# EAGLE schematic Ice-LogicBench (EAGLE 7.5.0)
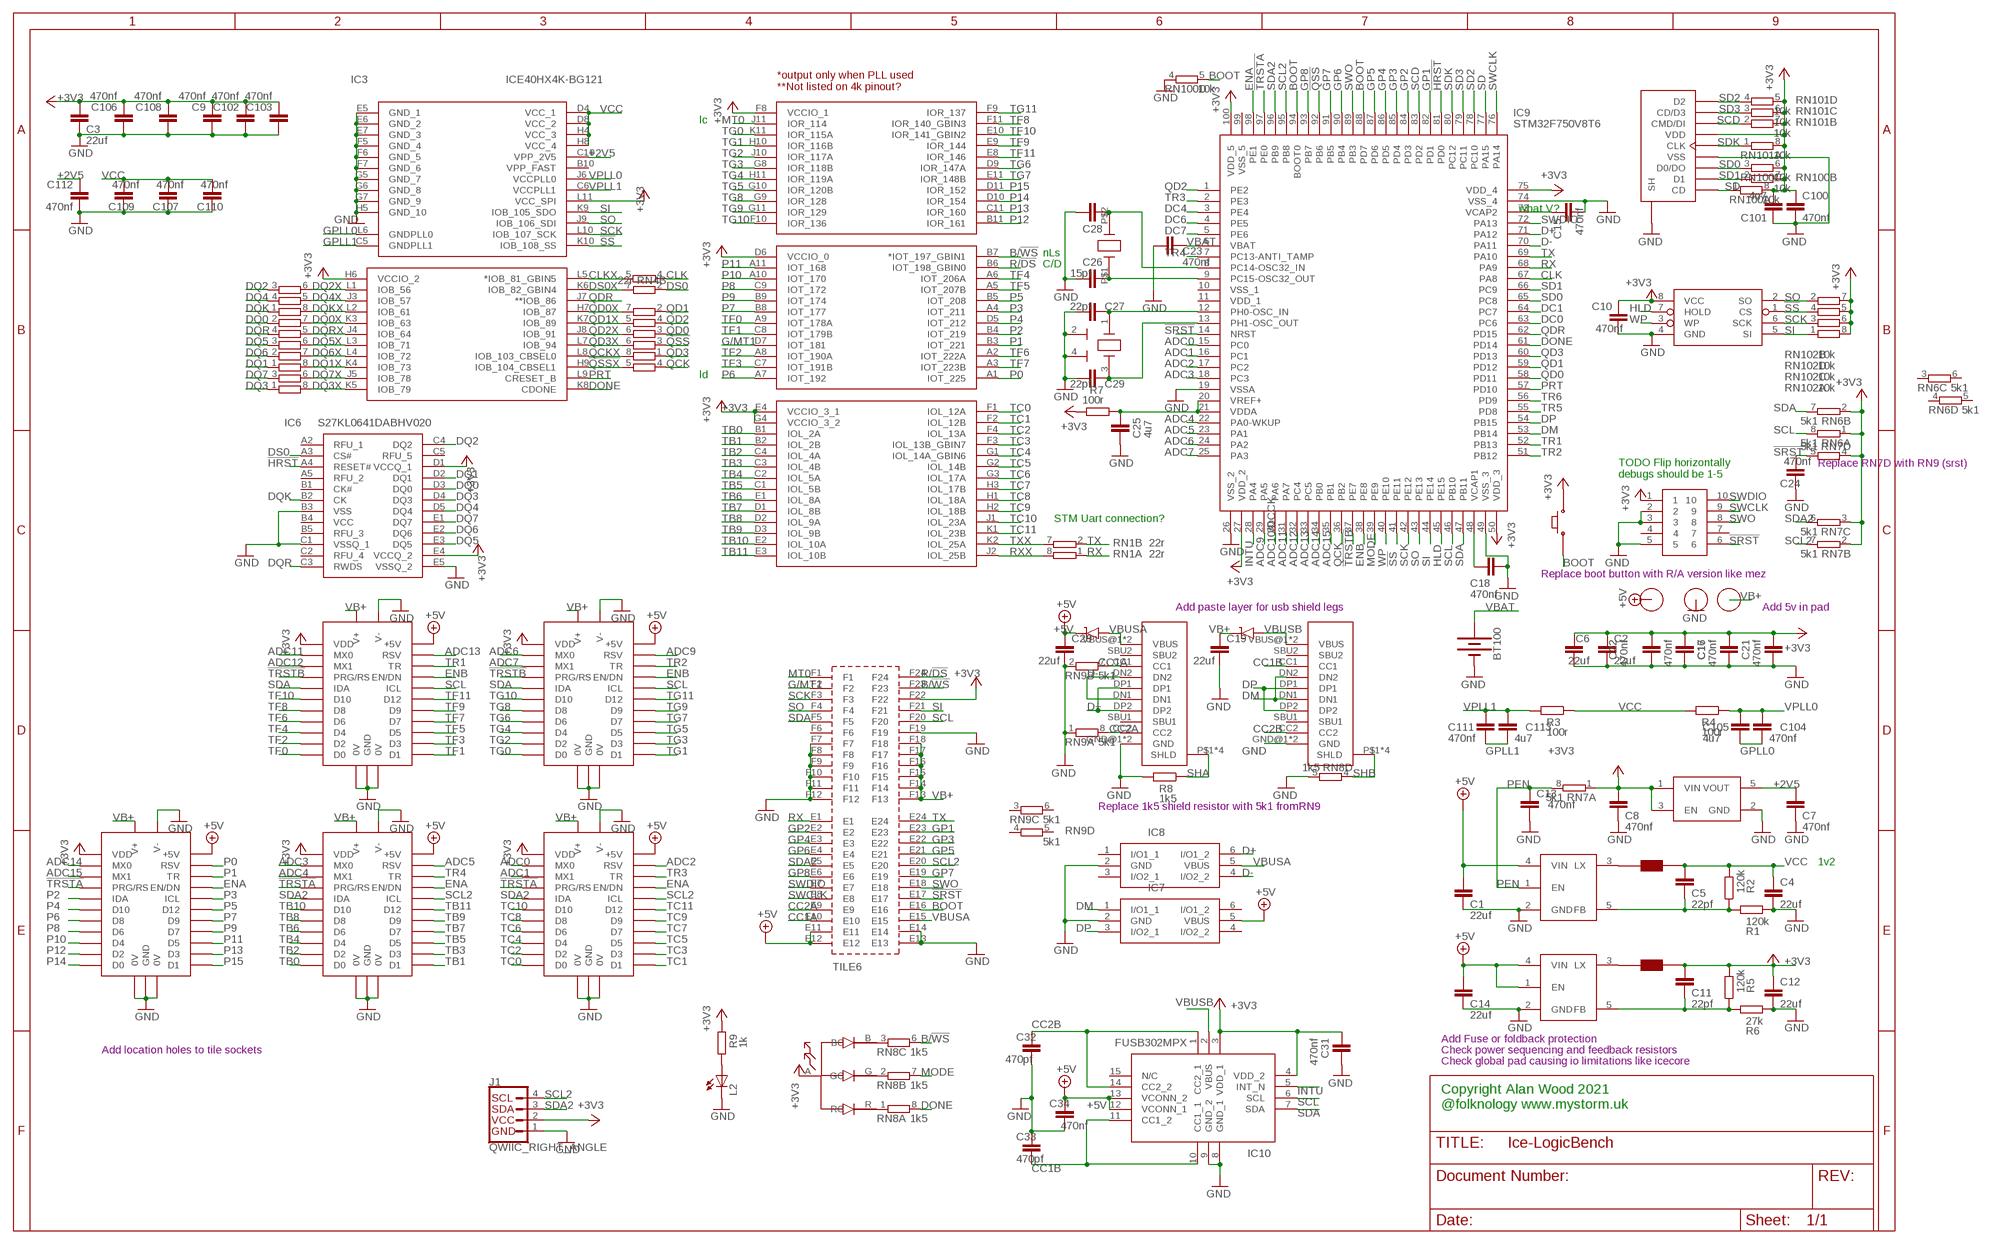
[diagram p0: schematic, sheet 1]

## Parts
B1  PUSH_BUTTON  [3X4MM_BUTTON]
BT100  BATTERY-20MM_SMD  [BATTCON_20MM]
C1  22uf  C-EUC0603  [C0603]
C2  22uf  C-EUC0603  [C0603]
C3  22uf  C-EUC0603  [C0603]
C4  22uf  C-EUC0603  [C0603]
C5  22pf  C-EUC0402  [C0402]
C6  22uf  C-EUC0603  [C0603]
C7  470nf  C-EUC0402  [C0402]
C8  470nf  C-EUC0402  [C0402]
C9  470nf  C-EUC0402  [C0402]
C10  470nf  C-EUC0402  [C0402]
C11  22pf  C-EUC0402  [C0402]
C12  22uf  C-EUC0603  [C0603]
C13  470nf  C-EUC0402  [C0402]
C14  22uf  C-EUC0603  [C0603]
C15  470nf  C-EUC0402  [C0402]
C16  470nf  C-EUC0402  [C0402]
C17  470nf  C-EUC0402  [C0402]
C18  470nf  C-EUC0402  [C0402]
C19  22uf  C-EUC0603  [C0603]
C20  22uf  C-EUC0603  [C0603]
C21  470nf  C-EUC0402  [C0402]
C22  470nf  C-EUC0402  [C0402]
C23  470nf  C-EUC0402  [C0402]
C24  470nf  C-EUC0402  [C0402]
C25  4u7  C-EUC0402  [C0402]
C26  15pf  C-EUC0402  [C0402]
C27  22pf  C-EUC0402  [C0402]
C28  15pf  C-EUC0402  [C0402]
C29  22pf  C-EUC0402  [C0402]
C31  470nf  C-EUC0402  [C0402]
C32  470pf  C-EUC0402  [C0402]
C33  470pf  C-EUC0402  [C0402]
C34  470nf  C-EUC0402  [C0402]
C100  470nf  C-EUC0402  [C0402]
C101  4u7  C-EUC0402  [C0402]
C102  470nf  C-EUC0402  [C0402]
C103  470nf  C-EUC0402  [C0402]
C104  470nf  C-EUC0402  [C0402]
C105  4u7  C-EUC0402  [C0402]
C106  470nf  C-EUC0402  [C0402]
C107  470nf  C-EUC0402  [C0402]
C108  470nf  C-EUC0402  [C0402]
C109  470nf  C-EUC0402  [C0402]
C110  470nf  C-EUC0402  [C0402]
C111  470nf  C-EUC0402  [C0402]
C112  470nf  C-EUC0402  [C0402]
C113  4u7  C-EUC0402  [C0402]
CN1  USB-C-16  [USB-C]
CN2  USB-C-16  [USB-C]
CN3  2X5-HEADER  [1.27-2X5-HEADER]
H1  HOLE2.5MM-LARGE  [2M5-LARGE]
H3  HOLE2.5MM-LARGE  [2M5-LARGE]
H4  HOLE2.5MM-LARGE  [2M5-LARGE]
I1  NRS4018  [NRC4018]
I2  NRS4018  [NRC4018]
IC1  AP3429/A  [TSOP-5/SOT23-5]
IC2  NCP114  [TSOP-5/SOT23-5]
IC3  ICE40HX4K-BG121  [BGA121C80P11X11_900X900X110]
IC4  AT25SDF041A  [SOIC-8-NARROW]
IC5  AP3429/A  [TSOP-5/SOT23-5]
IC6  S27KL0641DABHV020  [BGA24C100P5X5_600X800X100]
IC7  USBLC6-2SC6  [SOT95P280X145-6N]
IC8  USBLC6-2SC6  [SOT95P280X145-6N]
IC9  STM32F750V8T6  [QFP50P1600X1600X160-100N]
IC10  FUSB302MPX  [QFN50P250X250X80-15N]
J1  QWIIC_RIGHT_ANGLE  QWIIC_CONNECTORJS-1MM  [JST04_1MM_RA]
L1  RGB_LED  [RGB_LED_IMM]
L2  LEDCHIPLED_1206  [CHIPLED_1206]
R1  120k  R-EU_R0402  [R0402]
R2  120k  R-EU_R0402  [R0402]
R3  100r  R-EU_R0402  [R0402]
R4  100r  R-EU_R0402  [R0402]
R5  120k  R-EU_R0402  [R0402]
R6  27k  R-EU_R0402  [R0402]
R7  100r  R-EU_R0402  [R0402]
R8  1k5  R-EU_R0402  [R0402]
R9  1k  R-EU_R0402  [R0402]
RN1  22r  4R-NEXB38V  [EXB38V]
RN2  22r  4R-NEXB38V  [EXB38V]
RN3  22r  4R-NEXB38V  [EXB38V]
RN4  22r  4R-NEXB38V  [EXB38V]
RN5  22r  4R-NEXB38V  [EXB38V]
RN6  5k1  4R-NEXB38V  [EXB38V]
RN7  5k1  4R-NEXB38V  [EXB38V]
RN8  1k5  4R-NEXB38V  [EXB38V]
RN9  5k1  4R-NEXB38V  [EXB38V]
RN100  10k  4R-NEXB38V  [EXB38V]
RN101  10k  4R-NEXB38V  [EXB38V]
RN102  10k  4R-NEXB38V  [EXB38V]
SD100  TF-15X15  [SDCARD]
TILE1  UTILE_LPCARRIER_SMD_MALE_1.27  [UTILE_LP]
TILE2  UTILE_LPCARRIER_SMD_MALE_1.27  [UTILE_LP]
TILE3  UTILE_LPCARRIER_SMD_MALE_1.27  [UTILE_LP]
TILE4  UTILE_LPCARRIER_SMD_MALE_1.27  [UTILE_LP]
TILE5  UTILE_LPCARRIER_SMD_MALE_1.27  [UTILE_LP]
TILE6  HYPER-TILECARRIER  [HYPER-TILE]
U$1  SS54  [SMA-NARROW]
U$2  SS54  [SMA-NARROW]
Y1  12MZ  7M-25  [CRYSTAL-3.2X2.5]
Y2  FC-135  [FC135]

## Nets
!HRST: IC6.A4(RESET#) IC9.81(PD0)
!QSS: IC9.92(PB6) RN4.3
!QSSX: IC3.H9(IOB_104_CBSEL1) RN5.5
!SRST: C24.2 CN3.6 IC9.14(NRST) RN7.5 TILE6.E17
!SS: IC3.K10(IOB_108_SS) IC4.1(CS) IC9.41(PE11) RN102.4
!TRSTA: IC9.97(PE0) TILE1.P$15(PRG/RS) TILE2.P$15(PRG/RS) TILE4.P$15(PRG/RS)
!TRSTB: IC9.37(PE7) TILE3.P$15(PRG/RS) TILE5.P$15(PRG/RS)
+2V5: C7.2 C112.1 IC2.5(VOUT) IC3.C10(VPP_2V5)
+3V3: B1.P$1 C2.1 C3.2 C6.2 C8.2 C9.1 C10.1 C11.2 C12.1 C16.2 C17.2 C21.2 C22.2 C31.2 C100.1 C101.2 C102.1 C103.1 C106.1 C108.1 CN3.1 I2.P$2 IC2.1(VIN) IC2.3(EN) IC3.D6(VCCIO_0) IC3.E4(VCCIO_3_1) IC3.F8(VCCIO_1) IC3.G4(VCCIO_3_2) IC3.H6(VCCIO_2) IC3.L11(VCC_SPI) IC4.8(VCC) IC6.D1(VCCQ_1) IC6.E4(VCCQ_2) IC9.27(VDD_2) IC9.50(VDD_3) IC9.75(VDD_4) IC9.100(VDD_5) IC10.3(VDD_1) IC10.4(VDD_2) J1.2 L1.A(ANODE) R5.2 R7.2 R9.1 RN6.1 RN6.2 RN7.1 RN7.2 RN7.3 RN7.4 RN100.6 RN100.7 RN100.8 RN101.5 RN101.6 RN101.7 RN101.8 RN102.5 RN102.6 RN102.7 RN102.8 SD100.P$6(VDD) TILE1.P$18(VDD) TILE2.P$18(VDD) TILE3.P$18(VDD) TILE4.P$18(VDD) TILE5.P$18(VDD) TILE6.F22
+5V: C1.2 C14.2 C20.1 C34.2 H1.P$1(P) IC1.4(VIN) IC5.1(EN) IC5.4(VIN) IC7.5(VBUS) IC10.12(VCONN_1) IC10.13(VCONN_2) TILE1.P$43(+5V) TILE2.P$43(+5V) TILE3.P$43(+5V) TILE4.P$43(+5V) TILE5.P$43(+5V) TILE6.E11 TILE6.E12 U$2.C(CATHODE)
ADC0: IC9.15(PC0) TILE4.P$17(MX0)
ADC1: IC9.16(PC1) TILE4.P$16(MX1)
ADC2: IC9.17(PC2) TILE4.P$42(RSV)
ADC3: IC9.18(PC3) TILE1.P$17(MX0)
ADC4: IC9.22(PA0-WKUP) TILE1.P$16(MX1)
ADC5: IC9.23(PA1) TILE1.P$42(RSV)
ADC6: IC9.24(PA2) TILE5.P$17(MX0)
ADC7: IC9.25(PA3) TILE5.P$16(MX1)
ADC9: IC9.29(PA5) TILE5.P$42(RSV)
ADC10/DCCK: IC9.30(PA6)
ADC11: IC9.31(PA7) TILE3.P$17(MX0)
ADC12: IC9.32(PC4) TILE3.P$16(MX1)
ADC13: IC9.33(PC5) TILE3.P$42(RSV)
ADC14: IC9.34(PB0) TILE2.P$17(MX0)
ADC15: IC9.35(PB1) TILE2.P$16(MX1)
B/!WS: IC3.B7(*IOT_197_GBIN1) RN8.6 TILE6.F23
BOOT: B1.P$2 IC9.88(PD7) IC9.94(BOOT0) RN100.5 TILE6.E16
CC1A: CN1.CC1 RN9.7 TILE6.E10
CC1B: C33.1 CN2.CC1 IC10.10(CC1_1) IC10.11(CC1_2)
CC2A: CN1.CC2 RN9.8 TILE6.E9
CC2B: C32.2 CN2.CC2 IC10.1(CC2_1) IC10.14(CC2_2)
CLK: IC9.67(PA8) RN3.4
CLKX: IC3.L5(*IOB_81_GBIN5) RN3.5
D+: CN1.DP1 CN1.DP2 IC8.6(I/O1_2) IC9.71(PA12)
D-: CN1.DN1 CN1.DN2 IC8.4(I/O2_2) IC9.70(PA11)
DC0: IC9.63(PC6)
DC1: IC9.64(PC7)
DC4: IC9.3(PE4)
DC6: IC9.4(PE5)
DC7: IC9.5(PE6)
DM: CN2.DN1 CN2.DN2 IC7.1(I/O1_1) IC9.53(PB14)
DONE: IC3.K8(CDONE) IC9.61(PD14) RN8.8
DP: CN2.DP1 CN2.DP2 IC7.3(I/O2_1) IC9.54(PB15)
DQ0: IC6.D3(DQ0) RN2.2
DQ0X: IC3.K3(IOB_63) RN2.7
DQ1: IC6.D2(DQ1) RN3.1
DQ1X: IC3.K4(IOB_73) RN3.8
DQ2: IC6.C4(DQ2) RN1.3
DQ2X: IC3.L1(IOB_56) RN1.6
DQ3: IC6.D4(DQ3) RN4.1
DQ3X: IC3.K5(IOB_79) RN4.8
DQ4: IC6.D5(DQ4) RN1.4
DQ4X: IC3.J3(IOB_57) RN1.5
DQ5: IC6.E3(DQ5) RN2.3
DQ5X: IC3.L3(IOB_71) RN2.6
DQ6: IC6.E2(DQ6) RN3.2
DQ6X: IC3.L4(IOB_72) RN3.7
DQ7: IC6.E1(DQ7) RN3.3
DQ7X: IC3.J5(IOB_78) RN3.6
DQK: IC6.B2(CK) RN2.1
DQKX: IC3.L2(IOB_61) RN2.8
DQR: IC6.C3(RWDS) RN2.4
DQRX: IC3.J4(IOB_64) RN2.5
DS0: IC6.A3(CS#) RN4.2
DS0X: IC3.K6(IOB_82_GBIN4) RN4.7
ENA: IC9.98(PE1) TILE1.P$40(EN/DN) TILE2.P$40(EN/DN) TILE4.P$40(EN/DN)
ENB: IC9.38(PE8) TILE3.P$40(EN/DN) TILE5.P$40(EN/DN)
G/MT1: IC3.D7(IOT_181) TILE6.F2
GND: BT100.2(-) C1.1 C2.2 C3.1 C4.2 C6.1 C7.1 C8.1 C9.2 C10.2 C12.2 C13.2 C14.1 C15.2 C16.1 C17.1 C18.1 C19.2 C20.2 C21.1 C22.1 C23.2 C24.1 C25.2 C26.1 C27.1 C28.1 C29.1 C31.1 C32.1 C33.2 C34.1 C100.2 C101.1 C102.2 C103.2 C106.2 C107.1 C108.2 C109.1 C110.1 C112.2 CN1.GND@1(GND) CN1.GND@2(GND) CN2.GND@1(GND) CN2.GND@2(GND) CN3.2 CN3.3 CN3.5 H3.P$1(P) IC1.2(GND) IC2.2(GND) IC3.E5(GND_1) IC3.E6(GND_2) IC3.E7(GND_3) IC3.F5(GND_4) IC3.F6(GND_5) IC3.F7(GND_6) IC3.G5(GND_7) IC3.G6(GND_8) IC3.G7(GND_9) IC3.H5(GND_10) IC4.4(GND) IC5.2(GND) IC6.B3(VSS) IC6.C1(VSSQ_1) IC6.E5(VSSQ_2) IC7.2(GND) IC8.2(GND) IC9.19(VSSA) IC9.26(VSS_2) IC9.49(VSS_3) IC9.74(VSS_4) IC10.8(GND_1) IC10.9(GND_2) J1.1 L2.C R1.2 R6.2 R8.2 RN8.5 RN9.1 RN9.2 RN100.4 SD100.P$4(VSS) SD100.P$10(SH) SD100.P$11(SH) SD100.P$12(SH) SD100.P$13(SH) TILE1.0V@1(0V) TILE1.0V@2(0V) TILE1.P$1(V-) TILE1.P$2(V-) TILE1.P$3(V-) TILE1.P$4(V-) TILE1.P$5(V-) TILE1.P$6(V-) TILE1.P$7(GND) TILE1.P$26(V-) TILE1.P$27(V-) TILE1.P$28(V-) TILE1.P$29(V-) TILE1.P$30(V-) TILE1.P$31(V-) TILE1.P$32(GND) TILE2.0V@1(0V) TILE2.0V@2(0V) TILE2.P$1(V-) TILE2.P$2(V-) TILE2.P$3(V-) TILE2.P$4(V-) TILE2.P$5(V-) TILE2.P$6(V-) TILE2.P$7(GND) TILE2.P$26(V-) TILE2.P$27(V-) TILE2.P$28(V-) TILE2.P$29(V-) TILE2.P$30(V-) TILE2.P$31(V-) TILE2.P$32(GND) TILE3.0V@1(0V) TILE3.0V@2(0V) TILE3.P$1(V-) TILE3.P$2(V-) TILE3.P$3(V-) TILE3.P$4(V-) TILE3.P$5(V-) TILE3.P$6(V-) TILE3.P$7(GND) TILE3.P$26(V-) TILE3.P$27(V-) TILE3.P$28(V-) TILE3.P$29(V-) TILE3.P$30(V-) TILE3.P$31(V-) TILE3.P$32(GND) TILE4.0V@1(0V) TILE4.0V@2(0V) TILE4.P$1(V-) TILE4.P$2(V-) TILE4.P$3(V-) TILE4.P$4(V-) TILE4.P$5(V-) TILE4.P$6(V-) TILE4.P$7(GND) TILE4.P$26(V-) TILE4.P$27(V-) TILE4.P$28(V-) TILE4.P$29(V-) TILE4.P$30(V-) TILE4.P$31(V-) TILE4.P$32(GND) TILE5.0V@1(0V) TILE5.0V@2(0V) TILE5.P$1(V-) TILE5.P$2(V-) TILE5.P$3(V-) TILE5.P$4(V-) TILE5.P$5(V-) TILE5.P$6(V-) TILE5.P$7(GND) TILE5.P$26(V-) TILE5.P$27(V-) TILE5.P$28(V-) TILE5.P$29(V-) TILE5.P$30(V-) TILE5.P$31(V-) TILE5.P$32(GND) TILE6.E13 TILE6.E14 TILE6.F7 TILE6.F8 TILE6.F9 TILE6.F10 TILE6.F11 TILE6.F12 TILE6.F19 Y1.2(GND) Y1.4(GND)
GP1: IC9.82(PD1) TILE6.E23
GP2: IC9.84(PD3) TILE6.E2
GP3: IC9.85(PD4) TILE6.E22
GP4: IC9.86(PD5) TILE6.E3
GP5: IC9.87(PD6) TILE6.E21
GP6: IC9.90(PB4) TILE6.E4
GP7: IC9.91(PB5) TILE6.E19
GP8: IC9.93(PB7) TILE6.E6
GPLL0: C104.1 C105.1 IC3.L6(GNDPLL0)
GPLL1: C111.1 C113.1 IC3.C5(GNDPLL1)
HLD: IC4.7(HOLD) IC9.45(PE15)
INTU: IC9.28(PA4) IC10.5(INT_N)
MODE: IC9.39(PE9) RN8.7
MT0: IC3.J11(IOR_114) TILE6.F1
N$1: L2.A R9.2
N$2: L1.G(GC) RN8.2
N$4: L1.R(RC) RN8.1
N$6: L1.B(BC) RN8.3
N$10: C29.2 IC9.13(PH1-OSC_OUT) Y1.3(X2)
N$11: C27.2 IC9.12(PH0-OSC_IN) Y1.1(X1)
N$12: C26.2 IC9.9(PC15-OSC32_OUT) Y2.P$1(X1)
N$13: C28.2 IC9.8(PC14-OSC32_IN) Y2.P$2(X2)
N$14: C15.1 IC9.73(VCAP2)
N$18: C11.1 IC5.5(FB) R5.1 R6.1
N$19: I2.P$1 IC5.3(LX)
N$87: C18.2 IC9.48(VCAP1)
N$88: C25.1 IC9.20(VREF+) IC9.21(VDDA) R7.1
N$93: C5.1 IC1.5(FB) R1.1 R2.1
N$94: I1.P$1 IC1.3(LX)
P0: IC3.A1(IOT_225) TILE2.P$42(RSV)
P1: IC3.B3(IOT_221) TILE2.P$41(TR)
P2: IC3.B4(IOT_219) TILE2.P$14(IDA)
P3: IC3.A4(IOT_211) TILE2.P$39(ICL)
P4: IC3.D5(IOT_212) TILE2.P$13(D10)
P5: IC3.B5(IOT_208) TILE2.P$38(D12)
P6: IC3.A7(IOT_192) TILE2.P$12(D8)
P7: IC3.B8(IOT_177) TILE2.P$37(D9)
P8: IC3.C9(IOT_172) TILE2.P$11(D6)
P9: IC3.B9(IOT_174) TILE2.P$36(D7)
P10: IC3.A10(IOT_170) TILE2.P$10(D4)
P11: IC3.A11(IOT_168) TILE2.P$35(D5)
P12: IC3.B11(IOR_161) TILE2.P$9(D2)
P13: IC3.C11(IOR_160) TILE2.P$34(D3)
P14: IC3.D10(IOR_154) TILE2.P$8(D0)
P15: IC3.D11(IOR_152) TILE2.P$33(D1)
PEN: C13.1 IC1.1(EN) RN7.8
PRT: IC3.L9(CRESET_B) IC9.57(PD10)
QCK: IC9.36(PB2) RN5.4
QCKX: IC3.L8(IOB_103_CBSEL0) RN5.8
QD0: IC9.58(PD11) RN5.3
QD0X: IC3.H7(IOB_87) RN5.7
QD1: IC9.59(PD12) RN5.2
QD1X: IC3.K7(IOB_89) RN4.5
QD2: IC9.1(PE2) RN4.4
QD2X: IC3.J8(IOB_91) RN5.6
QD3: IC9.60(PD13) RN5.1
QD3X: IC3.L7(IOB_94) RN4.6
QDR: IC3.J7(**IOB_86) IC9.62(PD15)
R/!DS: IC3.B6(IOT_198_GBIN0) TILE6.F24
RX: IC9.68(PA9) RN1.1 TILE6.E1
RXX: IC3.J2(IOL_25B) RN1.8
SCD: IC9.83(PD2) RN101.2 SD100.P$7(CMD/DI)
SCK: IC3.L10(IOB_107_SCK) IC4.6(SCK) IC9.42(PE12) RN102.3 TILE6.F3
SCL: IC9.46(PB10) IC10.6(SCL) RN6.8 TILE3.P$39(ICL) TILE5.P$39(ICL) TILE6.F20
SCL2: IC9.95(PB8) J1.4 RN7.7 TILE1.P$39(ICL) TILE4.P$39(ICL) TILE6.E20
SD: IC9.77(PA15) RN100.1 SD100.P$1(CD)
SD0: IC9.65(PC8) RN100.3 SD100.P$3(D0/DO)
SD1: IC9.66(PC9) RN100.2 SD100.P$2(D1)
SD2: IC9.78(PC10) RN101.4 SD100.P$9(D2)
SD3: IC9.79(PC11) RN101.3 SD100.P$8(CD/D3)
SDA: IC9.47(PB11) IC10.7(SDA) RN6.7 TILE3.P$14(IDA) TILE5.P$14(IDA) TILE6.F5
SDA2: IC9.96(PB9) J1.3 RN7.6 TILE1.P$14(IDA) TILE4.P$14(IDA) TILE6.E5
SDK: IC9.80(PC12) RN101.1 SD100.P$5(CLK)
SHA: CN1.P$1(SHLD) CN1.P$2(SHLD) CN1.P$3(SHLD) CN1.P$4(SHLD) R8.1
SHB: CN2.P$1(SHLD) CN2.P$2(SHLD) CN2.P$3(SHLD) CN2.P$4(SHLD) RN8.4
SI: IC3.K9(IOB_105_SDO) IC4.5(SI) IC9.44(PE14) RN102.1 TILE6.F21
SO: IC3.J9(IOB_106_SDI) IC4.2(SO) IC9.43(PE13) RN102.2 TILE6.F4
SWCLK: CN3.9 IC9.76(PA14) TILE6.E8
SWDIO: CN3.10 IC9.72(PA13) TILE6.E7
SWO: CN3.8 IC9.89(PB3) TILE6.E18
TB0: IC3.B1(IOL_2A) TILE1.P$8(D0)
TB1: IC3.B2(IOL_2B) TILE1.P$33(D1)
TB2: IC3.C4(IOL_4A) TILE1.P$9(D2)
TB3: IC3.C3(IOL_4B) TILE1.P$34(D3)
TB4: IC3.C2(IOL_5A) TILE1.P$10(D4)
TB5: IC3.C1(IOL_5B) TILE1.P$35(D5)
TB6: IC3.E1(IOL_8A) TILE1.P$11(D6)
TB7: IC3.D1(IOL_8B) TILE1.P$36(D7)
TB8: IC3.D2(IOL_9A) TILE1.P$12(D8)
TB9: IC3.D3(IOL_9B) TILE1.P$37(D9)
TB10: IC3.E2(IOL_10A) TILE1.P$13(D10)
TB11: IC3.E3(IOL_10B) TILE1.P$38(D12)
TC0: IC3.F1(IOL_12A) TILE4.P$8(D0)
TC1: IC3.F2(IOL_12B) TILE4.P$33(D1)
TC2: IC3.F4(IOL_13A) TILE4.P$9(D2)
TC3: IC3.F3(IOL_13B_GBIN7) TILE4.P$34(D3)
TC4: IC3.G1(IOL_14A_GBIN6) TILE4.P$10(D4)
TC5: IC3.G2(IOL_14B) TILE4.P$35(D5)
TC6: IC3.G3(IOL_17A) TILE4.P$11(D6)
TC7: IC3.H3(IOL_17B) TILE4.P$36(D7)
TC8: IC3.H1(IOL_18A) TILE4.P$12(D8)
TC9: IC3.H2(IOL_18B) TILE4.P$37(D9)
TC10: IC3.J1(IOL_23A) TILE4.P$13(D10)
TC11: IC3.K1(IOL_23B) TILE4.P$38(D12)
TF0: IC3.A9(IOT_178A) TILE3.P$8(D0)
TF1: IC3.C8(IOT_179B) TILE3.P$33(D1)
TF2: IC3.A8(IOT_190A) TILE3.P$9(D2)
TF3: IC3.C7(IOT_191B) TILE3.P$34(D3)
TF4: IC3.A6(IOT_206A) TILE3.P$10(D4)
TF5: IC3.A5(IOT_207B) TILE3.P$35(D5)
TF6: IC3.A2(IOT_222A) TILE3.P$11(D6)
TF7: IC3.A3(IOT_223B) TILE3.P$36(D7)
TF8: IC3.F11(IOR_140_GBIN3) TILE3.P$12(D8)
TF9: IC3.E9(IOR_144) TILE3.P$37(D9)
TF10: IC3.E10(IOR_141_GBIN2) TILE3.P$13(D10)
TF11: IC3.E8(IOR_146) TILE3.P$38(D12)
TG0: IC3.K11(IOR_115A) TILE5.P$8(D0)
TG1: IC3.H10(IOR_116B) TILE5.P$33(D1)
TG2: IC3.J10(IOR_117A) TILE5.P$9(D2)
TG3: IC3.G8(IOR_118B) TILE5.P$34(D3)
TG4: IC3.H11(IOR_119A) TILE5.P$10(D4)
TG5: IC3.G10(IOR_120B) TILE5.P$35(D5)
TG6: IC3.D9(IOR_147A) TILE5.P$11(D6)
TG7: IC3.E11(IOR_148B) TILE5.P$36(D7)
TG8: IC3.G9(IOR_128) TILE5.P$12(D8)
TG9: IC3.G11(IOR_129) TILE5.P$37(D9)
TG10: IC3.F10(IOR_136) TILE5.P$13(D10)
TG11: IC3.F9(IOR_137) TILE5.P$38(D12)
TR1: IC9.52(PB13) TILE3.P$41(TR)
TR2: IC9.51(PB12) TILE5.P$41(TR)
TR3: IC9.2(PE3) TILE4.P$41(TR)
TR4: IC9.7(PC13-ANTI_TAMP) TILE1.P$41(TR)
TR5: IC9.55(PD8)
TR6: IC9.56(PD9)
TX: IC9.69(PA10) RN1.2 TILE6.E24
TXX: IC3.K2(IOL_25A) RN1.7
VB+: C19.1 H4.P$1(P) TILE1.P$20(V+) TILE1.P$21(V+) TILE1.P$22(V+) TILE1.P$23(V+) TILE1.P$24(V+) TILE1.P$25(V+) TILE1.P$45(V+) TILE1.P$46(V+) TILE1.P$47(V+) TILE1.P$48(V+) TILE1.P$49(V+) TILE1.P$50(V+) TILE2.P$20(V+) TILE2.P$21(V+) TILE2.P$22(V+) TILE2.P$23(V+) TILE2.P$24(V+) TILE2.P$25(V+) TILE2.P$45(V+) TILE2.P$46(V+) TILE2.P$47(V+) TILE2.P$48(V+) TILE2.P$49(V+) TILE2.P$50(V+) TILE3.P$20(V+) TILE3.P$21(V+) TILE3.P$22(V+) TILE3.P$23(V+) TILE3.P$24(V+) TILE3.P$25(V+) TILE3.P$45(V+) TILE3.P$46(V+) TILE3.P$47(V+) TILE3.P$48(V+) TILE3.P$49(V+) TILE3.P$50(V+) TILE4.P$20(V+) TILE4.P$21(V+) TILE4.P$22(V+) TILE4.P$23(V+) TILE4.P$24(V+) TILE4.P$25(V+) TILE4.P$45(V+) TILE4.P$46(V+) TILE4.P$47(V+) TILE4.P$48(V+) TILE4.P$49(V+) TILE4.P$50(V+) TILE5.P$20(V+) TILE5.P$21(V+) TILE5.P$22(V+) TILE5.P$23(V+) TILE5.P$24(V+) TILE5.P$25(V+) TILE5.P$45(V+) TILE5.P$46(V+) TILE5.P$47(V+) TILE5.P$48(V+) TILE5.P$49(V+) TILE5.P$50(V+) TILE6.F13 TILE6.F14 TILE6.F15 TILE6.F16 TILE6.F17 TILE6.F18 U$1.C(CATHODE)
VBAT: BT100.1(+) C23.1 IC9.6(VBAT)
VBUSA: CN1.VBUS@1(VBUS) CN1.VBUS@2(VBUS) IC8.5(VBUS) TILE6.E15 U$2.A(ANODE)
VBUSB: CN2.VBUS@1(VBUS) CN2.VBUS@2(VBUS) IC10.2(VBUS) U$1.A(ANODE)
VCC: C4.1 C5.2 C107.2 C109.2 C110.2 I1.P$2 IC3.D4(VCC_1) IC3.D8(VCC_2) IC3.H4(VCC_3) IC3.H8(VCC_4) R2.2 R3.1 R4.2
VPLL0: C104.2 C105.2 IC3.J6(VCCPLL0) R4.1
VPLL1: C111.2 C113.2 IC3.C6(VCCPLL1) R3.2
WP: IC4.3(WP) IC9.40(PE10)
Unconnected: CN1.SBU1 CN1.SBU2 CN2.SBU1 CN2.SBU2 CN3.4 CN3.7 IC2.4(NC) IC3.B10(VPP_FAST) IC6.A2(RFU_1) IC6.A5(RFU_2) IC6.B1(CK#) IC6.B4(VCC) IC6.B5(RFU_3) IC6.C2(RFU_4) IC6.C5(RFU_5) IC7.4(I/O2_2) IC7.6(I/O1_2) IC8.1(I/O1_1) IC8.3(I/O2_1) IC9.10(VSS_1) IC9.11(VDD_1) IC9.99(VSS_5) IC10.15(N/C) RN6.3 RN6.4 RN6.5 RN6.6 RN9.3 RN9.4 RN9.5 RN9.6 TILE6.F6

## Notes on the sheet
- lc
- what V?
- nLs
- C/D
- ld
- Replace RN7D with RN9 (srst)
- TODO Flip horizontally
  debugs should be 1-5
- STM Uart connection?
- Replace boot button with R/A version like mez
- Add paste layer for usb shield legs | Add 5v in pad
- Replace 1k5 shield resistor with 5k1 fromRN9
- 1v2
- Add Fuse or foldback protection
- Add location holes to tile sockets | Check power sequencing and feedback resistors
- Check global pad causing io limitations like icecore
- Copyright Alan Wood 2021
  @folknology www.mystorm.uk

## Library data of the parts
B1 = amino:PUSH_BUTTON
BT100 = SparkFun-Batteries:BATTERY: Battery - Single Cell A variety of battery chemistries, sizes, and footprints. Device List: 20MM_PTH - Coin Cell Battery Holder - 20mm (PTH) <https://www.sparkfun.com/products/783> 20MM_PTH_KIT- Coin Cell battery Holder - 20 mm (PTH) <http://www.sparkfun.com/products/783>kit version with special mask 6.8MM_PTH - Coin Cell Battery Holder - 6.8MM(SMD) <https://www.digikey.com/product-detail/en/seiko-instruments/MS621FE-FL11E/728-1057-ND/1889208?WT.srch=1&gclid=CNOQ5a6LzdQCFZS2wAodXCkE0g> 12MM_SMD - Coin Cell Battery Holder - 12mm (SMD) <https://www.sparkfun.com/products/10592> 12MM_PTH - Coin Cell Battery Holder - 12mm (PTH) <https://www.sparkfun.com/products/7948> 20MM_SMD - 20mm Coin Cell Battery Holder (SMD) (2 legs) Used on the Big Time Watch Kit <https://www.sparkfun.com/products/11734> 20MM_SMD_4LEGS - Coin Cell Battery Holder - 20mm (SMD) <https://www.sparkfun.com/products/11892> 20MM_SMD_4LEGS_OVERPASTE - Coin Cell Battery Holder - 20mm (SMD) <https://www.sparkfun.com/products/11892> (Over-paste on the legs) 24.5MM_PTH - Coin Cell Battery Holder - 24.5mm (PTH) <https://www.sparkfun.com/products/8863> 9V - 9V Battery Holder - PC Mount Used on the SparkFun SparkPunk Sound Kit <https://www.sparkfun.com/products/11177> and SparkFun SparkPunk Sequencer Kit <https://www.sparkfun.com/products/12707> 18650 - Battery Holder - 18650 (PTH) <https://www.sparkfun.com/products/13113> AA - Battery Holder - 1xAA (PTH) <https://www.sparkfun.com/products/7949> AAA - Battery Holder - 1xAAA (PTH) <https://www.sparkfun.com/products/12718> AA_KIT - Battery Holder - 1xAA (PTH) <https://www.sparkfun.com/products/7949> Special kit package - pads only have exposed copper on one side of the board. AAA_KIT - Battery Holder - 1xAAA (PTH) <https://www.sparkfun.com/products/12718> Special kit package - pads only have exposed copper on one side of the board.; PROD_ID: BATT-11519
C1-C29 C31-C34 C100-C113 = rcl:C-EU: CAPACITOR, European symbol
CN1 CN2 = amino:USB-C-16
CN3 = amino:2X5-HEADER
H1 H3 H4 = amino:HOLE
I1 I2 = amino:NRS4018
IC1 IC5 = amino:AP3429/A
IC2 = amino:NCP114
IC3 = SamacSys_Parts:ICE40HX4K-BG121: IC FPGA 93 I/O 121CABGA Source: Datasheet <http://www.latticesemi.com/iCE40>; DESCRIPTION: IC FPGA 93 I/O 121CABGA; HEIGHT: 1.1mm; MANUFACTURER_NAME: Lattice Semiconductor; MANUFACTURER_PART_NUMBER: ICE40HX4K-BG121; MOUSER_PART_NUMBER: 842-ICE40HX4K-BG121; MOUSER_PRICE-STOCK: https://www.mouser.co.uk/ProductDetail/Lattice/ICE40HX4K-BG121?qs=r5DSvlrkXmJ1BLZOg5%2FxBQ%3D%3D
IC4 = amino:AT25SDF041A
IC6 = SamacSys_Parts:S27KL0641DABHV020: CYPRESS SEMICONDUCTOR - S27KL0641DABHV020 - DRAM, 64MBIT, 36NS, FBGA-24 Source: Datasheet <https://www.cypress.com/file/183506/download>; DESCRIPTION: CYPRESS SEMICONDUCTOR - S27KL0641DABHV020 - DRAM, 64MBIT, 36NS, FBGA-24; HEIGHT: 1mm; MANUFACTURER_NAME: Cypress Semiconductor; MANUFACTURER_PART_NUMBER: S27KL0641DABHV020; MOUSER_PART_NUMBER: 727-S27KL0641DABHV02; MOUSER_PRICE-STOCK: https://www.mouser.co.uk/ProductDetail/Cypress-Semiconductor/S27KL0641DABHV020?qs=74EMXstkWMU1y2SuN5BsMA%3D%3D
IC7 IC8 = SamacSys_Parts:USBLC6-2SC6: TVS Diode Array Uni-Directional USBLC6-2SC6 17V, SOT-23 6-Pin Source: Datasheet <http://www.st.com/st-web-ui/static/active/en/resource/technical/document/datasheet/CD00050750.pdf>; DESCRIPTION: TVS Diode Array Uni-Directional USBLC6-2SC6 17V, SOT-23 6-Pin; HEIGHT: 1.45mm; MANUFACTURER_NAME: STMicroelectronics; MANUFACTURER_PART_NUMBER: USBLC6-2SC6; MOUSER_PART_NUMBER: 511-USBLC6-2SC6; MOUSER_PRICE-STOCK: https://www.mouser.co.uk/ProductDetail/STMicroelectronics/USBLC6-2SC6?qs=po45yt2pPpu%2FhNIlwQdTlg%3D%3D
IC9 = SamacSys_Parts:STM32F750V8T6: STMICROELECTRONICS - STM32F750V8T6 - MCU, 32BIT, 216MHZ, LQFP-100 Source: Datasheet <https://www.st.com/resource/en/datasheet/stm32f750v8.pdf>; DESCRIPTION: STMICROELECTRONICS - STM32F750V8T6 - MCU, 32BIT, 216MHZ, LQFP-100; HEIGHT: 1.6mm; MANUFACTURER_NAME: STMicroelectronics; MANUFACTURER_PART_NUMBER: STM32F750V8T6; MOUSER_PART_NUMBER: 511-STM32F750V8T6; MOUSER_PRICE-STOCK: https://www.mouser.co.uk/ProductDetail/STMicroelectronics/STM32F750V8T6?qs=%252BEew9%252B0nqrBG59alEpQKbw%3D%3D
IC10 = SamacSys_Parts:FUSB302MPX: USB-C Controller w/PD 2.0 WQFN-14 Source: Datasheet <http://www.onsemi.com/pub/Collateral/FUSB302-D.PDF>; DESCRIPTION: USB-C Controller w/PD 2.0 WQFN-14; HEIGHT: 0.8mm; MANUFACTURER_NAME: ON Semiconductor; MANUFACTURER_PART_NUMBER: FUSB302MPX; MOUSER_PART_NUMBER: 512-FUSB302MPX; MOUSER_PRICE-STOCK: https://www.mouser.co.uk/ProductDetail/ON-Semiconductor-Fairchild/FUSB302MPX?qs=4SZXFaw57sm8ZmQ7q6qVtQ%3D%3D
J1 = SparkFun-Connectors:QWIIC_CONNECTOR: SparkFun I2C Standard Qwiic Connector An SMD 1mm pitch JST connector makes it easy and quick (get it? Qwiic?) to connect I2C devices to each other. The Qwiic system <http://www.sparkfun.com/qwiic> enables fast and solderless connection between popular platforms and various sensors and actuators. We carry 200mm <https://www.sparkfun.com/products/14204>, 100mm <https://www.sparkfun.com/products/14205>, 50mm <https://www.sparkfun.com/products/14206>, and breadboard friendly <https://www.sparkfun.com/products/14207> Qwiic cables. We also offer 10 pcs strips <https://www.sparkfun.com/products/14323> the SMD connectors.; PROD_ID: CONN-13694
L1 = amino:RGB_LED
L2 = led:LED: LED OSRAM: - CHIPLED LG R971, LG N971, LY N971, LG Q971, LY Q971, LO R971, LY R971 LH N974, LH R974 LS Q976, LO Q976, LY Q976 LO Q996 - Hyper CHIPLED LW Q18S LB Q993, LB Q99A, LB R99A - SideLED LS A670, LO A670, LY A670, LG A670, LP A670 LB A673, LV A673, LT A673, LW A673 LH A674 LY A675 LS A676, LA A676, LO A676, LY A676, LW A676 LS A679, LY A679, LG A679 - Hyper Micro SIDELED® LS Y876, LA Y876, LO Y876, LY Y876 LT Y87S - SmartLED LW L88C, LW L88S LB L89C, LB L89S, LG L890 LS L89K, LO L89K, LY L89K LS L896, LA L896, LO L896, LY L896 - TOPLED LS T670, LO T670, LY T670, LG T670, LP T670 LSG T670, LSP T670, LSY T670, LOP T670, LYG T670 LG T671, LOG T671, LSG T671 LB T673, LV T673, LT T673, LW T673 LH T674 LS T676, LA T676, LO T676, LY T676, LB T676, LH T676, LSB T676, LW T676 LB T67C, LV T67C, LT T67C, LS T67K, LO T67K, LY T67K, LW E67C LS E67B, LA E67B, LO E67B, LY E67B, LB E67C, LV E67C, LT E67C LW T67C LS T679, LY T679, LG T679 LS T770, LO T770, LY T770, LG T770, LP T770 LB T773, LV T773, LT T773, LW T773 LH T774 LS E675, LA E675, LY E675, LS T675 LS T776, LA T776, LO T776, LY T776, LB T776 LHGB T686 LT T68C, LB T68C - Hyper Mini TOPLED® LB M676 - Mini TOPLED Santana® LG M470 LS M47K, LO M47K, LY M47K Source: http://www.osram.convergy.de LUXEON: - LUMILED® LXK2-PW12-R00, LXK2-PW12-S00, LXK2-PW14-U00, LXK2-PW14-V00 LXK2-PM12-R00, LXK2-PM12-S00, LXK2-PM14-U00 LXK2-PE12-Q00, LXK2-PE12-R00, LXK2-PE12-S00, LXK2-PE14-T00, LXK2-PE14-U00 LXK2-PB12-K00, LXK2-PB12-L00, LXK2-PB12-M00, LXK2-PB14-N00, LXK2-PB14-P00, LXK2-PB14-Q00 LXK2-PR12-L00, LXK2-PR12-M00, LXK2-PR14-Q00, LXK2-PR14-R00 LXK2-PD12-Q00, LXK2-PD12-R00, LXK2-PD12-S00 LXK2-PH12-R00, LXK2-PH12-S00 LXK2-PL12-P00, LXK2-PL12-Q00, LXK2-PL12-R00 Source: www.luxeon.com KINGBRIGHT: KA-3528ASYC Source: www.kingbright.com
R1-R9 = resistor:R-EU_: RESISTOR, European symbol
RN1-RN9 RN100-RN102 = resistor-dil:4R-N: Array Chip Resistor Source: RS Component / Phycomp; OC_FARNELL: unknown; OC_NEWARK: unknown
SD100 = amino:TF-15X15
TILE1-TILE5 = amino:UTILE_LP
TILE6 = amino:HYPER-TILE
U$1 U$2 = amino:SS54
Y1 = amino:7M-25
Y2 = amino:FC-135